# EAGLE schematic Encoder_respaldos (EAGLE 6.1)

## Sheet 1 of 2
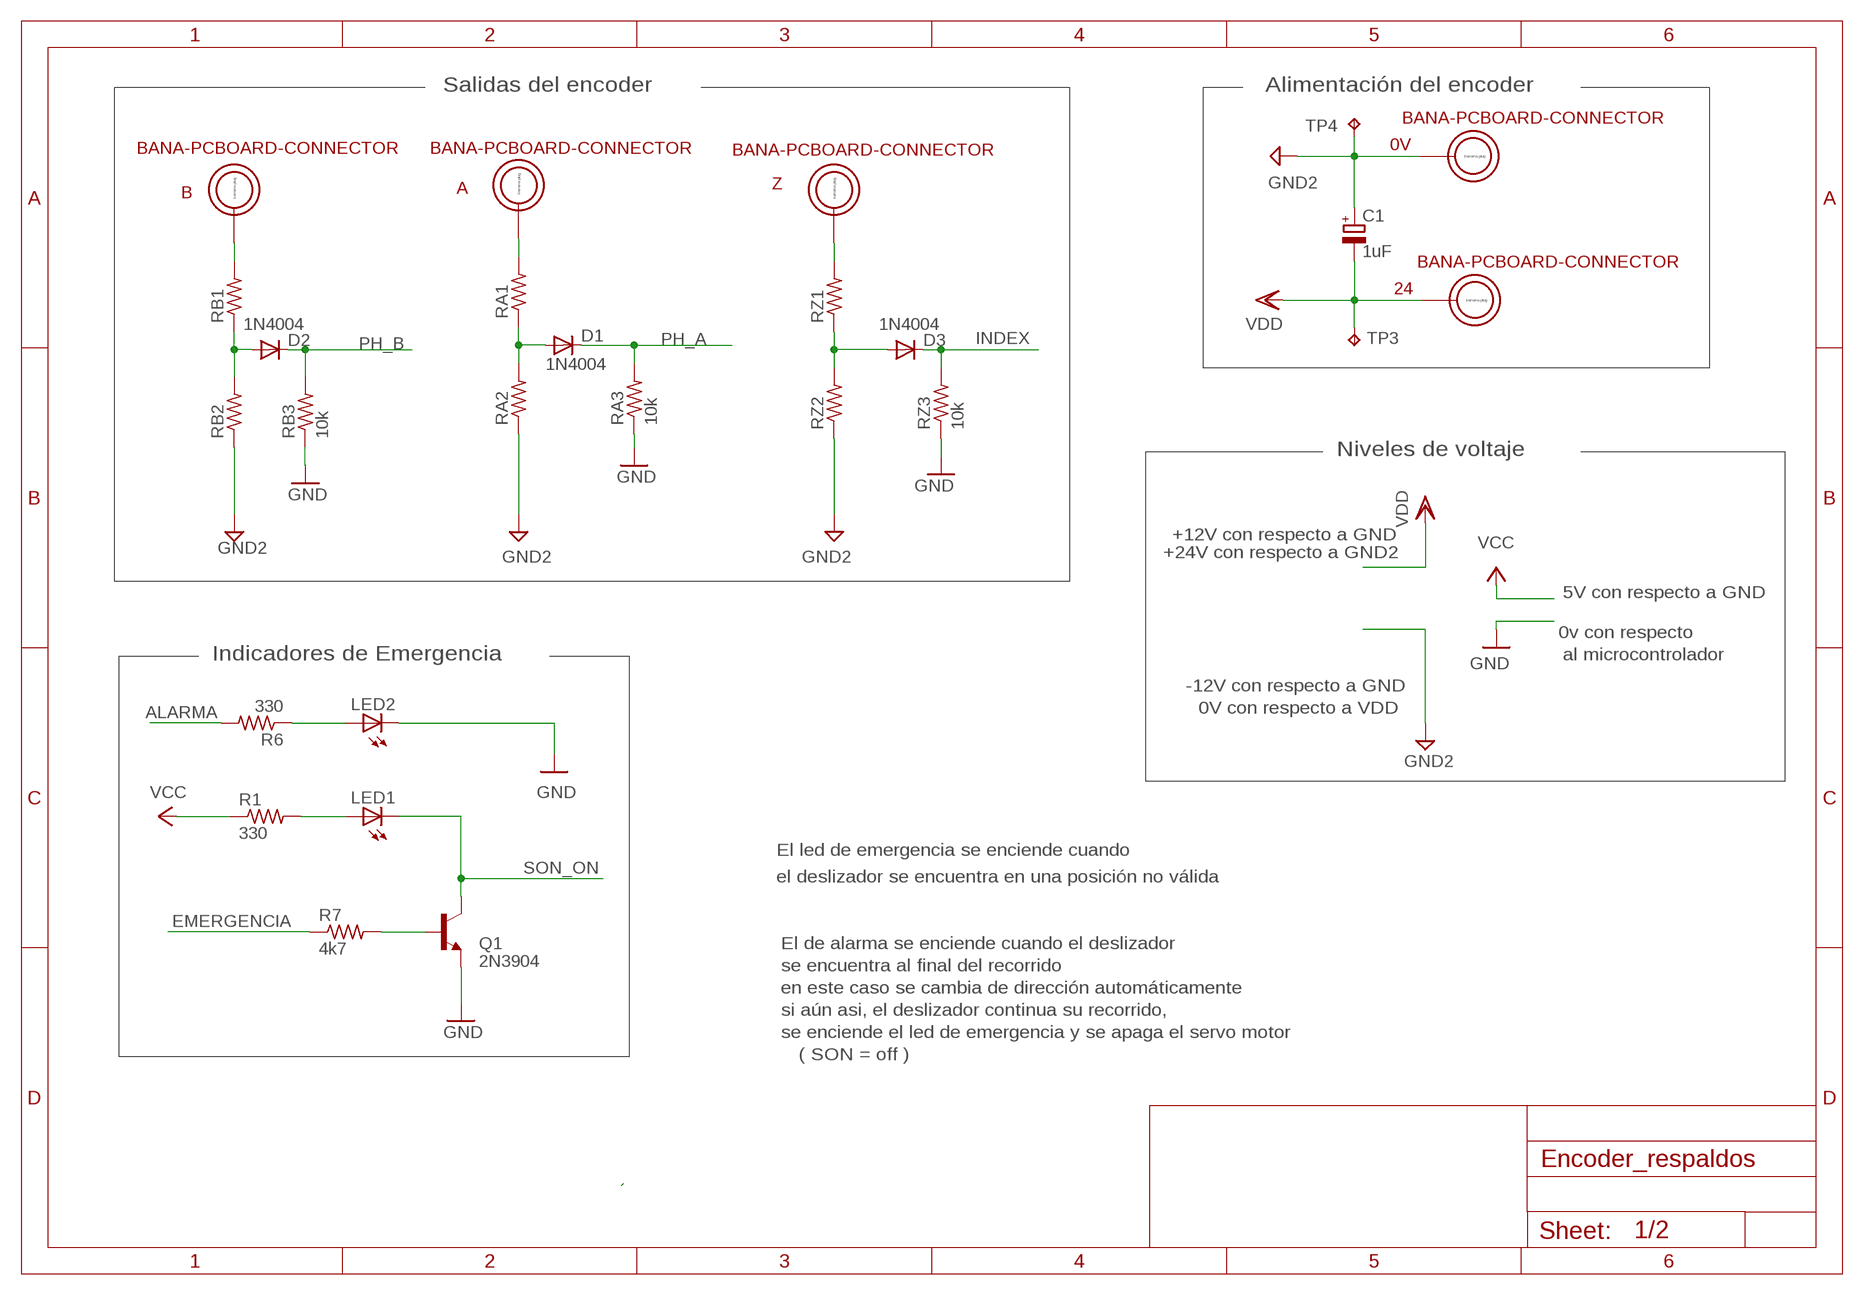
[diagram p0: schematic, sheet 1]

### Parts
0V  BANA-PCBOARD-CONNECTOR  [BANA_PLUG]
24  BANA-PCBOARD-CONNECTOR  [BANA_PLUG]
A  BANA-PCBOARD-CONNECTOR  [BANA_PLUG]
B  BANA-PCBOARD-CONNECTOR  [BANA_PLUG]
C1  1uF  CPOL-EUE2.5-6  [E2,5-6]
D1  1N4004  [DO41-10]
D2  1N4004  [DO41-10]
D3  1N4004  [DO41-10]
LED1  LED5MM  [LED5MM]
LED2  LED5MM  [LED5MM]
Q1  2N3904  [TO92]
R1  330  R-US_0204/7  [0204/7]
R6  330  R-US_0204/7  [0204/7]
R7  4k7  R-US_0204/7  [0204/7]
RA1  R-US_0204/7  [0204/7]
RA2  R-US_0204/7  [0204/7]
RA3  10k  R-US_0204/7  [0204/7]
RB1  R-US_0204/7  [0204/7]
RB2  R-US_0204/7  [0204/7]
RB3  10k  R-US_0204/7  [0204/7]
RZ1  R-US_0204/7  [0204/7]
RZ2  R-US_0204/7  [0204/7]
RZ3  10k  R-US_0204/7  [0204/7]
TP3  TPB2,54  [B2,54]
TP4  TPB2,54  [B2,54]
Z  BANA-PCBOARD-CONNECTOR  [BANA_PLUG]

### Nets
ALARMA: R6.2 ; also sheet 2
EMERGENCIA: R7.1 ; also sheet 2
GND [tierra_5v]: LED2.K(C) Q1.3(E) RA3.1 RB3.1 RZ3.1 ; also sheet 2
GND2: 0V.P$1 C1.+ RA2.1 RB2.1 RZ2.1 TP4.TP ; also sheet 2
INDEX: D3.C RZ3.2 ; also sheet 2
N$1: Q1.2(B) R7.2
N$3: LED1.A R1.2
N$6: LED2.A R6.1
N$8: D1.A RA1.1 RA2.2
N$10: D2.A RB1.1 RB2.2
N$12: RZ1.2 Z.P$1
N$16: B.P$1 RB1.2
N$17: A.P$1 RA1.2
N$19: D3.A RZ1.1 RZ2.2
PH_A: D1.C RA3.2 ; also sheet 2
PH_B: D2.C RB3.2 ; also sheet 2
SON_ON: LED1.K(C) Q1.1(C) ; also sheet 2
VCC [fuente_5v]: R1.1 ; also sheet 2
VDD [fuente_24]: 24.P$1 C1.- TP3.TP ; also sheet 2

### Notes on the sheet
- Salidas del encoder | Alimentación del encoder
- Niveles de voltaje
- +12V con respecto a GND
- +24V con respecto a GND2
- 5V con respecto a GND
- 0v con respecto
- Indicadores de Emergencia | al microcontrolador
- -12V con respecto a GND
- 0V con respecto a VDD
- El led de emergencia se enciende cuando
- el deslizador se encuentra en una posición no válida
- El de alarma se enciende cuando el deslizador
- se encuentra al final del recorrido
- en este caso se cambia de dirección automáticamente
- si aún asi, el deslizador continua su recorrido,
- se enciende el led de emergencia y se apaga el servo motor
- ( SON = off )

## Sheet 2 of 2
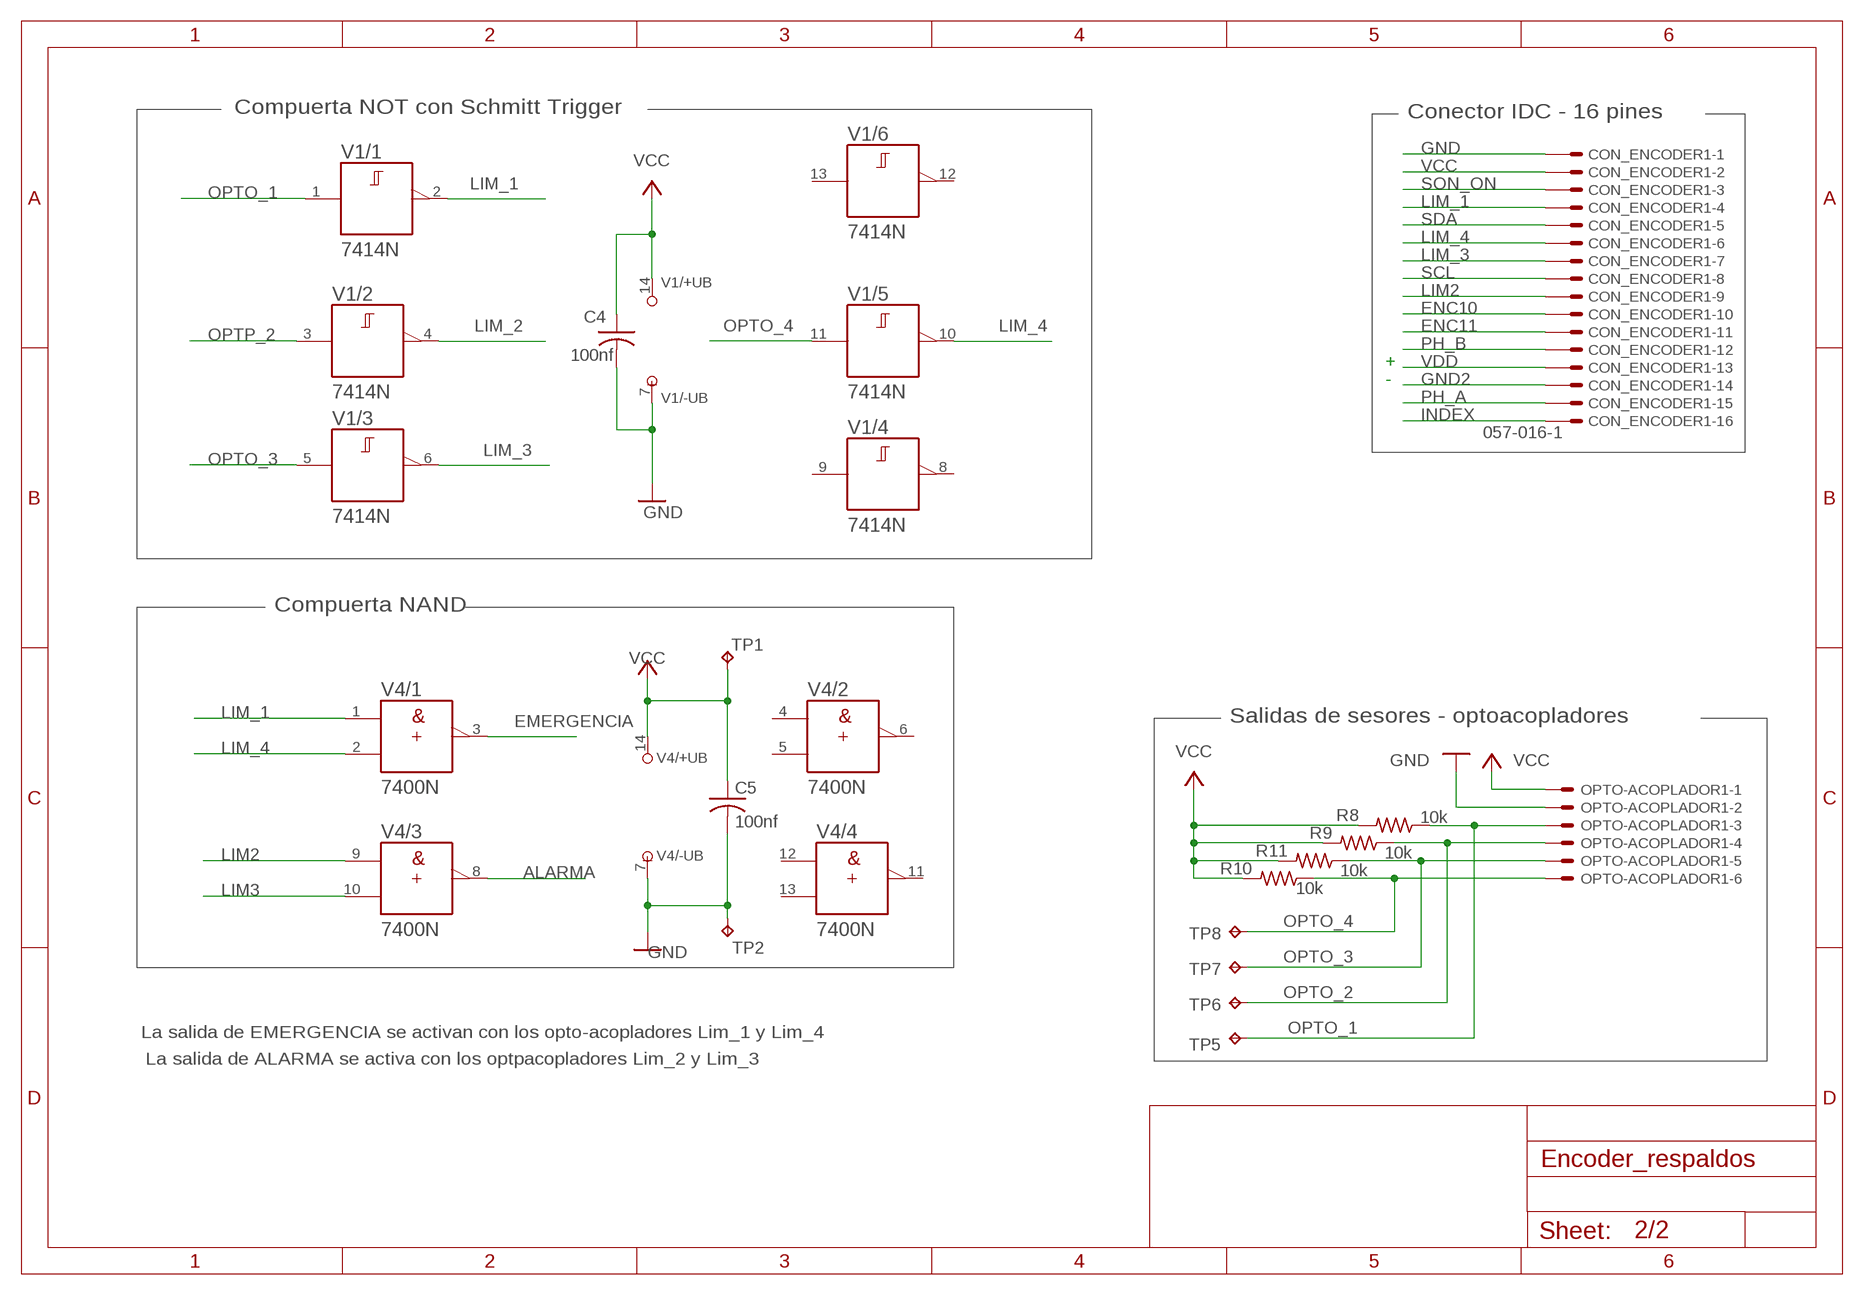
[diagram p1: schematic, sheet 2]

### Parts
C4  100nf  C-US025-024X044  [C025-024X044]
C5  100nf  C-US025-024X044  [C025-024X044]
CON_ENCODER1  057-016-1  [057-016-1]
OPTO-ACOPLADOR1  22-23-2061  [22-23-2061]
R8  10k  R-US_0204/7  [0204/7]
R9  10k  R-US_0204/7  [0204/7]
R10  10k  R-US_0204/7  [0204/7]
R11  10k  R-US_0204/7  [0204/7]
TP1  TPB2,54  [B2,54]
TP2  TPB2,54  [B2,54]
TP5  TPB2,54  [B2,54]
TP6  TPB2,54  [B2,54]
TP7  TPB2,54  [B2,54]
TP8  TPB2,54  [B2,54]
V1  7414N  [DIL14]
V4  7400N  [DIL14]

### Nets
ALARMA: V4.8(/3:Y) ; also sheet 1
EMERGENCIA: V4.3(/1:Y) ; also sheet 1
ENC10: CON_ENCODER1.10
ENC11: CON_ENCODER1.11
GND [tierra_5v]: C4.2 C5.2 CON_ENCODER1.1 OPTO-ACOPLADOR1.2 TP2.TP V1.7(/-UB:-UB) V4.7(/-UB:-UB) ; also sheet 1
GND2: CON_ENCODER1.14 ; also sheet 1
INDEX: CON_ENCODER1.16 ; also sheet 1
LIM2: CON_ENCODER1.9 V4.9(/3:A)
LIM3: V4.10(/3:B)
LIM_1: CON_ENCODER1.4 V1.2(/1:Y) V4.1(/1:A)
LIM_2: V1.4(/2:Y)
LIM_3: CON_ENCODER1.7 V1.6(/3:Y)
LIM_4: CON_ENCODER1.6 V1.10(/5:Y) V4.2(/1:B)
OPTO_1: OPTO-ACOPLADOR1.3 R8.1 TP5.TP V1.1(/1:A)
OPTO_2: OPTO-ACOPLADOR1.4 R9.1 TP6.TP
OPTO_3: OPTO-ACOPLADOR1.5 R11.1 TP7.TP V1.5(/3:A)
OPTO_4: OPTO-ACOPLADOR1.6 R10.1 TP8.TP V1.11(/5:A)
OPTP_2: V1.3(/2:A)
PH_A: CON_ENCODER1.15 ; also sheet 1
PH_B: CON_ENCODER1.12 ; also sheet 1
SCL: CON_ENCODER1.8
SDA: CON_ENCODER1.5
SON_ON: CON_ENCODER1.3 ; also sheet 1
VCC [fuente_5v]: C4.1 C5.1 CON_ENCODER1.2 OPTO-ACOPLADOR1.1 R8.2 R9.2 R10.2 R11.2 TP1.TP V1.14(/+UB:+UB) V4.14(/+UB:+UB) ; also sheet 1
VDD [fuente_24]: CON_ENCODER1.13 ; also sheet 1
Unconnected: V1.8(/4:Y) V1.9(/4:A) V1.12(/6:Y) V1.13(/6:A) V4.4(/2:A) V4.5(/2:B) V4.6(/2:Y) V4.11(/4:Y) V4.12(/4:A) V4.13(/4:B)

### Notes on the sheet
- Compuerta NOT con Schmitt Trigger | Conector IDC - 16 pines
- +
- -
- Compuerta NAND
- Salidas de sesores - optoacopladores
- La salida de EMERGENCIA se activan con los opto-acopladores Lim_1 y Lim_4
- La salida de ALARMA se activa con los optpacopladores Lim_2 y Lim_3

## Library data of the parts
0V 24 A B Z = banana-plug:BANA-PCBOARD-CONNECTOR: Banana Plug to PC Board connector
C1 = resistor:CPOL-EU: POLARIZED CAPACITOR, European symbol
C4 C5 = resistor:C-US: CAPACITOR, American symbol
CON_ENCODER1 = con-panduit:057-016-: CONNECTOR 10-pin series 057 contact pc board low profile headers; OC_FARNELL: unknown; OC_NEWARK: unknown
D1-D3 = diode:1N4004: DIODE general purpose rectifier, 1 A
LED1 LED2 = led:LED: LED OSRAM: - CHIPLED LG R971, LG N971, LY N971, LG Q971, LY Q971, LO R971, LY R971 LH N974, LH R974 LS Q976, LO Q976, LY Q976 LO Q996 - Hyper CHIPLED LW Q18S LB Q993, LB Q99A, LB R99A - SideLED LS A670, LO A670, LY A670, LG A670, LP A670 LB A673, LV A673, LT A673, LW A673 LH A674 LY A675 LS A676, LA A676, LO A676, LY A676, LW A676 LS A679, LY A679, LG A679 - Hyper Micro SIDELED® LS Y876, LA Y876, LO Y876, LY Y876 LT Y87S - SmartLED LW L88C, LW L88S LB L89C, LB L89S, LG L890 LS L89K, LO L89K, LY L89K LS L896, LA L896, LO L896, LY L896 - TOPLED LS T670, LO T670, LY T670, LG T670, LP T670 LSG T670, LSP T670, LSY T670, LOP T670, LYG T670 LG T671, LOG T671, LSG T671 LB T673, LV T673, LT T673, LW T673 LH T674 LS T676, LA T676, LO T676, LY T676, LB T676, LH T676, LSB T676, LW T676 LB T67C, LV T67C, LT T67C, LS T67K, LO T67K, LY T67K, LW E67C LS E67B, LA E67B, LO E67B, LY E67B, LB E67C, LV E67C, LT E67C LW T67C LS T679, LY T679, LG T679 LS T770, LO T770, LY T770, LG T770, LP T770 LB T773, LV T773, LT T773, LW T773 LH T774 LS E675, LA E675, LY E675, LS T675 LS T776, LA T776, LO T776, LY T776, LB T776 LHGB T686 LT T68C, LB T68C - Hyper Mini TOPLED® LB M676 - Mini TOPLED Santana® LG M470 LS M47K, LO M47K, LY M47K Source: http://www.osram.convergy.de LUXEON: - LUMILED® LXK2-PW12-R00, LXK2-PW12-S00, LXK2-PW14-U00, LXK2-PW14-V00 LXK2-PM12-R00, LXK2-PM12-S00, LXK2-PM14-U00 LXK2-PE12-Q00, LXK2-PE12-R00, LXK2-PE12-S00, LXK2-PE14-T00, LXK2-PE14-U00 LXK2-PB12-K00, LXK2-PB12-L00, LXK2-PB12-M00, LXK2-PB14-N00, LXK2-PB14-P00, LXK2-PB14-Q00 LXK2-PR12-L00, LXK2-PR12-M00, LXK2-PR14-Q00, LXK2-PR14-R00 LXK2-PD12-Q00, LXK2-PD12-R00, LXK2-PD12-S00 LXK2-PH12-R00, LXK2-PH12-S00 LXK2-PL12-P00, LXK2-PL12-Q00, LXK2-PL12-R00 Source: www.luxeon.com KINGBRIGHT: KA-3528ASYC Source: www.kingbright.com
OPTO-ACOPLADOR1 = con-molex:22-23-2061: .100" (2.54mm) Center Header - 6 Pin; MF: MOLEX; MPN: 22-23-2061; OC_FARNELL: 1462922; OC_NEWARK: 27C1933
Q1 = -redpic-diode-transistor:2N3904: NPN Transistor
R1 R6-R11 RA1-RA3 RB1-RB3 RZ1-RZ3 = rcl:R-US_: RESISTOR, American symbol
TP1-TP8 = testpad:TP: Test pad
V1 = 74ttl-din:74*14: Hex schmitt trigger INVERTER
V4 = 74ttl-din:74*00: Quad 2-input NAND gate

## Net classes
1 fuente_24: width 0.406 mm, clearance 0.305 mm
3 fuente_5v: width 0.356 mm
4 tierra_5v: width 0.356 mm